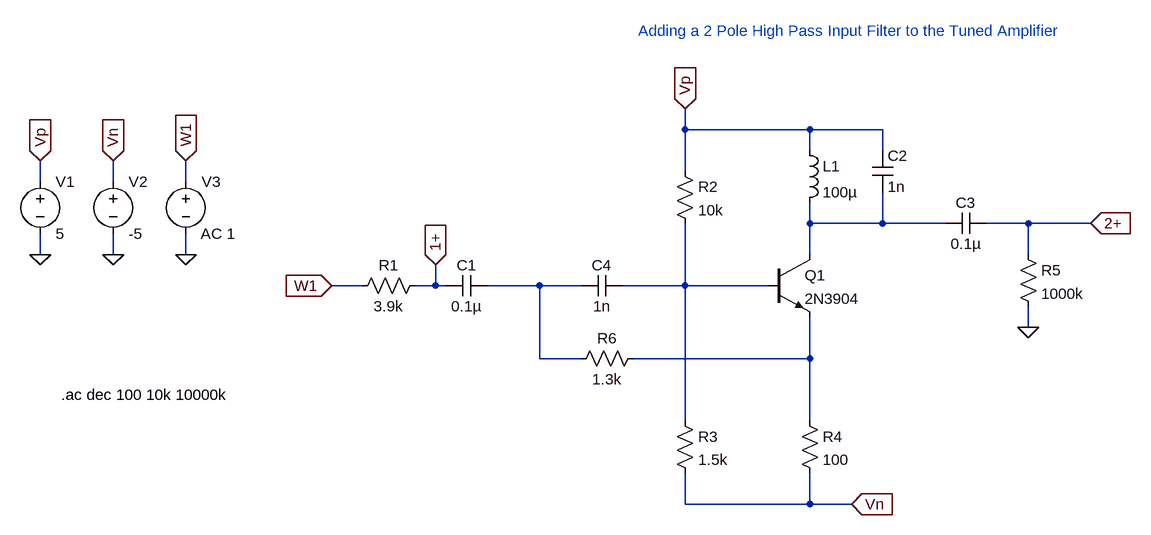
[diagram p0: schematic added_2pole_hpf_ltspice.asc]
added_2pole_hpf_ltspice.asc, the LTspice schematic file:
Version 4
SHEET 1 960 680
WIRE 240 -64 240 -96
WIRE 432 -64 240 -64
WIRE 544 -64 432 -64
WIRE 432 -32 432 -64
WIRE 544 -32 544 -64
WIRE 240 0 240 -64
WIRE -752 16 -752 -16
WIRE -640 16 -640 -16
WIRE -528 16 -528 -16
WIRE 432 80 432 48
WIRE 544 80 544 32
WIRE 544 80 432 80
WIRE 640 80 544 80
WIRE 768 80 704 80
WIRE 864 80 768 80
WIRE -752 128 -752 96
WIRE -640 128 -640 96
WIRE -528 128 -528 96
WIRE 432 128 432 80
WIRE 768 128 768 80
WIRE -256 176 -304 176
WIRE -144 176 -144 144
WIRE -144 176 -176 176
WIRE -128 176 -144 176
WIRE 16 176 -64 176
WIRE 80 176 16 176
WIRE 240 176 240 80
WIRE 240 176 144 176
WIRE 368 176 240 176
WIRE 768 240 768 208
WIRE 16 288 16 176
WIRE 80 288 16 288
WIRE 432 288 432 224
WIRE 432 288 160 288
WIRE 240 384 240 176
WIRE 432 384 432 288
WIRE 240 512 240 464
WIRE 432 512 432 464
WIRE 432 512 240 512
WIRE 496 512 432 512
FLAG 768 240 0
FLAG -304 176 W1
IOPIN -304 176 In
FLAG 864 80 2+
IOPIN 864 80 In
FLAG 496 512 Vn
IOPIN 496 512 In
FLAG 240 -96 Vp
IOPIN 240 -96 In
FLAG -144 144 1+
IOPIN -144 144 In
FLAG -752 128 0
FLAG -640 128 0
FLAG -528 128 0
FLAG -752 -16 Vp
IOPIN -752 -16 In
FLAG -640 -16 Vn
IOPIN -640 -16 In
FLAG -528 -16 W1
IOPIN -528 -16 In
SYMBOL res -160 160 R90
WINDOW 0 0 56 VBottom 2
WINDOW 3 32 56 VTop 2
SYMATTR InstName R1
SYMATTR Value 3.9k
SYMBOL cap -64 160 R90
WINDOW 0 0 32 VBottom 2
WINDOW 3 32 32 VTop 2
SYMATTR InstName C1
SYMATTR Value 0.1µ
SYMBOL res 224 -16 R0
SYMATTR InstName R2
SYMATTR Value 10k
SYMBOL res 224 368 R0
SYMATTR InstName R3
SYMATTR Value 1.5k
SYMBOL res 416 368 R0
SYMATTR InstName R4
SYMATTR Value 100
SYMBOL npn 368 128 R0
SYMATTR InstName Q1
SYMATTR Value 2N3904
SYMBOL ind 416 -48 R0
SYMATTR InstName L1
SYMATTR Value 100µ
SYMBOL cap 528 -32 R0
SYMATTR InstName C2
SYMATTR Value 1n
SYMBOL cap 704 64 R90
WINDOW 0 0 32 VBottom 2
WINDOW 3 32 32 VTop 2
SYMATTR InstName C3
SYMATTR Value 0.1µ
SYMBOL res 752 112 R0
SYMATTR InstName R5
SYMATTR Value 1000k
SYMBOL voltage -752 0 R0
WINDOW 123 0 0 Left 0
WINDOW 39 0 0 Left 0
SYMATTR InstName V1
SYMATTR Value 5
SYMBOL voltage -640 0 R0
WINDOW 123 0 0 Left 0
WINDOW 39 0 0 Left 0
SYMATTR InstName V2
SYMATTR Value -5
SYMBOL voltage -528 0 R0
WINDOW 123 23 96 Left 2
WINDOW 39 0 0 Left 0
SYMATTR Value2 AC 1
SYMATTR InstName V3
SYMATTR Value ""
SYMBOL cap 144 160 R90
WINDOW 0 0 32 VBottom 2
WINDOW 3 32 32 VTop 2
SYMATTR InstName C4
SYMATTR Value 1n
SYMBOL res 176 272 R90
WINDOW 0 0 56 VBottom 2
WINDOW 3 32 56 VTop 2
SYMATTR InstName R6
SYMATTR Value 1.3k
TEXT -720 344 Left 2 !.ac dec 100 10k 10000k
TEXT 168 -216 Left 2 ;Adding a 2 Pole High Pass Input Filter to the Tuned Amplifier

The netlist it stands for:
* added_2pole_hpf_ltspice.asc
R1 1+ W1 3.9k
C1 N002 1+ 0.1µ
R2 Vp N003 10k
R3 N003 Vn 1.5k
R4 N004 Vn 100
Q1 N001 N003 N004 0 2N3904
L1 Vp N001 100µ
C2 Vp N001 1n
C3 2+ N001 0.1µ
R5 2+ 0 1000k
V1 Vp 0 5
V2 Vn 0 -5
V3 W1 0 AC 1
C4 N003 N002 1n
R6 N004 N002 1.3k
.model NPN NPN
.model PNP PNP
.lib standard.bjt
.ac dec 100 10k 10000k
* Adding a 2 Pole High Pass Input Filter to the Tuned Amplifier
.backanno
.end